# EAGLE design Interconnect_Splice (EAGLE 6.5.0)
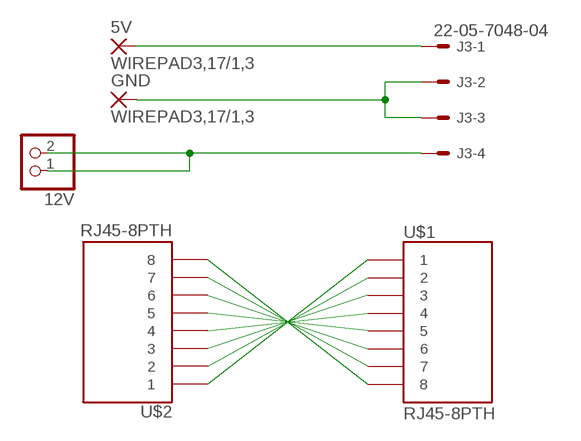
[diagram p0: schematic, sheet 1]

## Parts
5V  WIREPAD3,17/1,3  [3,17/1,3]
12V  PINHD-1X2/90  [1X02/90]
GND  WIREPAD3,17/1,3  [3,17/1,3]
J3  22-05-7048-04  [7395-04]
U$1  RJ45-8PTH  [RJ45-8]
U$2  RJ45-8PTH  [RJ45-8]

## Nets
GND: GND.1(P) J3.2 J3.3
N$2: 5V.1(P) J3.1
N$3: 12V.1 12V.2 J3.4
N$4: U$1.8 U$2.8
N$5: U$1.7 U$2.7
N$6: U$1.6 U$2.6
N$7: U$1.5 U$2.5
N$8: U$1.4 U$2.4
N$9: U$1.3 U$2.3
N$10: U$1.2 U$2.2
N$11: U$1.1 U$2.1

## Library data of the parts
5V GND = wirepad:WIREPAD: Wire PAD connect wire on PCB
12V = pinhead:PINHD-1X2: PIN HEADER
J3 = con-molex:22-?-04: CONNECTOR wire to board 2.54 mm (.1 inch) pitch header; OC_FARNELL: unknown; OC_NEWARK: unknown
U$1 U$2 = SparkFun-Connectors:RJ45-8: RJ45 Jack Simple RJ45, 8-pin connection - connector for common Cat5, Cat5e, and Cat6 Ethernet cables. Footprint not yet proven in production. Connector sku is PRT-00643; Breakout PCB sku is BOB-00716.

## Board
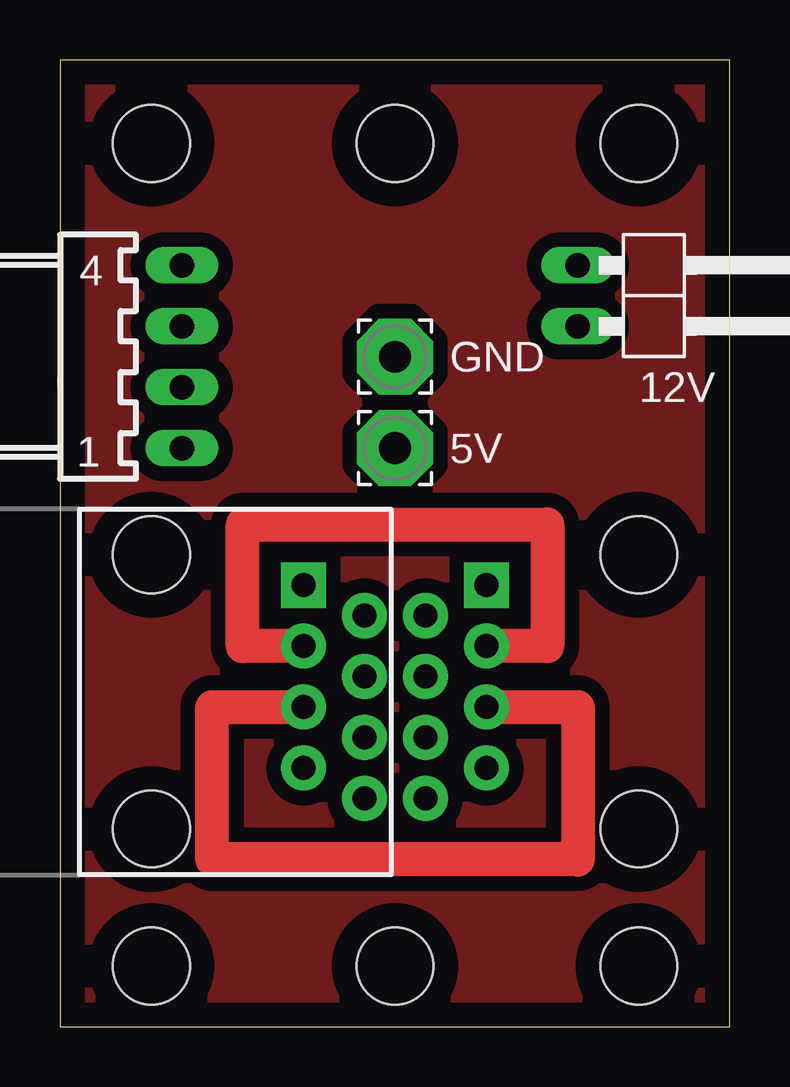
[diagram p1: board, top side]
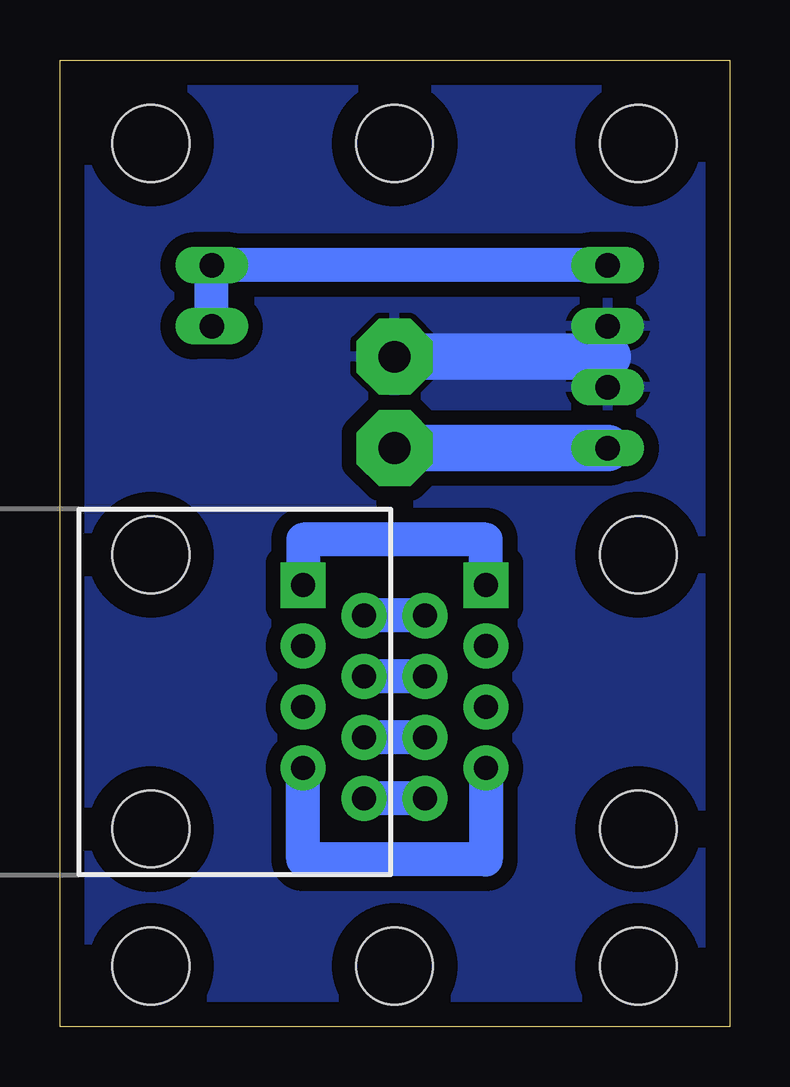
[diagram p2: board, bottom side, seen from below]

Size 27.92 x 40.31 mm. Coordinates in mm from the lower left corner, seen from the top.
Outline: 0,0 27.92,0 27.92,40.31 0,40.31 0,0
Copper layers (1*16): Top 0.035mm / dielectric 1.5mm / Bottom 0.035mm
Design rules "default": minimum track width 10mil, minimum drill 24mil, track to track 8mil, track to pad 8mil, pad to pad 8mil, via to via 8mil, smd to smd 8mil, copper to edge 40mil, drill to drill 8mil, minimum pad ring 10mil, minimum via ring 8mil, stop-mask expansion 4mil, vias tented up to drill 0mil, thermal gap 10mil
Holes 3.2 mm at 3.81,2.54 24.13,2.54 13.97,2.54 3.81,36.83 13.97,36.83 24.13,36.83

### Footprints (pad centres in the part's own frame; a part is rotated, then mirrored left to right if it is on the bottom)
3,17/1,3 = drill 1.321 pad 3.175 octagon: 1 0,0
1X02/90 = drill 1.016 long: 1 -1.27,-3.81; 2 1.27,-3.81
7395-04 = drill 1.016 long: 1 3.81,0; 2 1.27,0; 3 -1.27,0; 4 -3.81,0
RJ45-8 = drill 1 pad 1.88 square: 1 -4.445,6.35 | drill 1 pad 1.88: 2 -3.175,8.89; 3 -1.905,6.35; 4 -0.635,8.89; 5 0.635,6.35; 6 1.905,8.89; 7 3.175,6.35; 8 4.445,8.89 | hole 3.2: -5.715,0; 5.715,0

### Placement (x,y rotation side)
5V  13.97,24.13 0 top
12V  25.4,30.48 270 top
GND  13.97,27.94 0 top
J3  5.08,27.94 270 top
U$1  24.13,13.97 270 bottom
U$2  3.81,13.97 270 top

### Tracks (layer width: path | path; a pad name or v marks a point on that pad's centre or on a via)
GND
  Bottom 1.422: J3.2 5.08,27.94 J3.3
  Bottom 1.93: GND.1 5.08,27.94
  pour Bottom (isolate 0.61): 0,0 27.94,0 27.94,40.64 0,40.64
N$2
  Bottom 1.93: 5V.1 J3.1
N$3
  Bottom 1.422: J3.4 12V.1 12V.2
N$4
  Bottom 1.422: U$2.8 U$1.8
N$5
  Bottom 1.422: U$2.7 10.16,6.99 17.78,6.99 U$1.7
N$6
  Bottom 1.422: U$2.6 U$1.6
N$7
  Top 1.422: U$1.5 21.59,13.34 21.59,6.99 6.35,6.99 6.35,13.34 U$2.5
N$8
  Bottom 1.422: U$2.4 U$1.4
N$9
  Top 1.422: U$2.3 7.62,15.88 7.62,20.95 20.32,20.95 20.32,15.88 U$1.3
N$10
  Bottom 1.422: U$2.2 U$1.2
N$11
  Bottom 1.422: U$2.1 10.16,20.32 17.78,20.32 U$1.1
VCC
  pour Top (isolate 0.61): 0,0 27.94,0 27.94,40.64 0,40.64